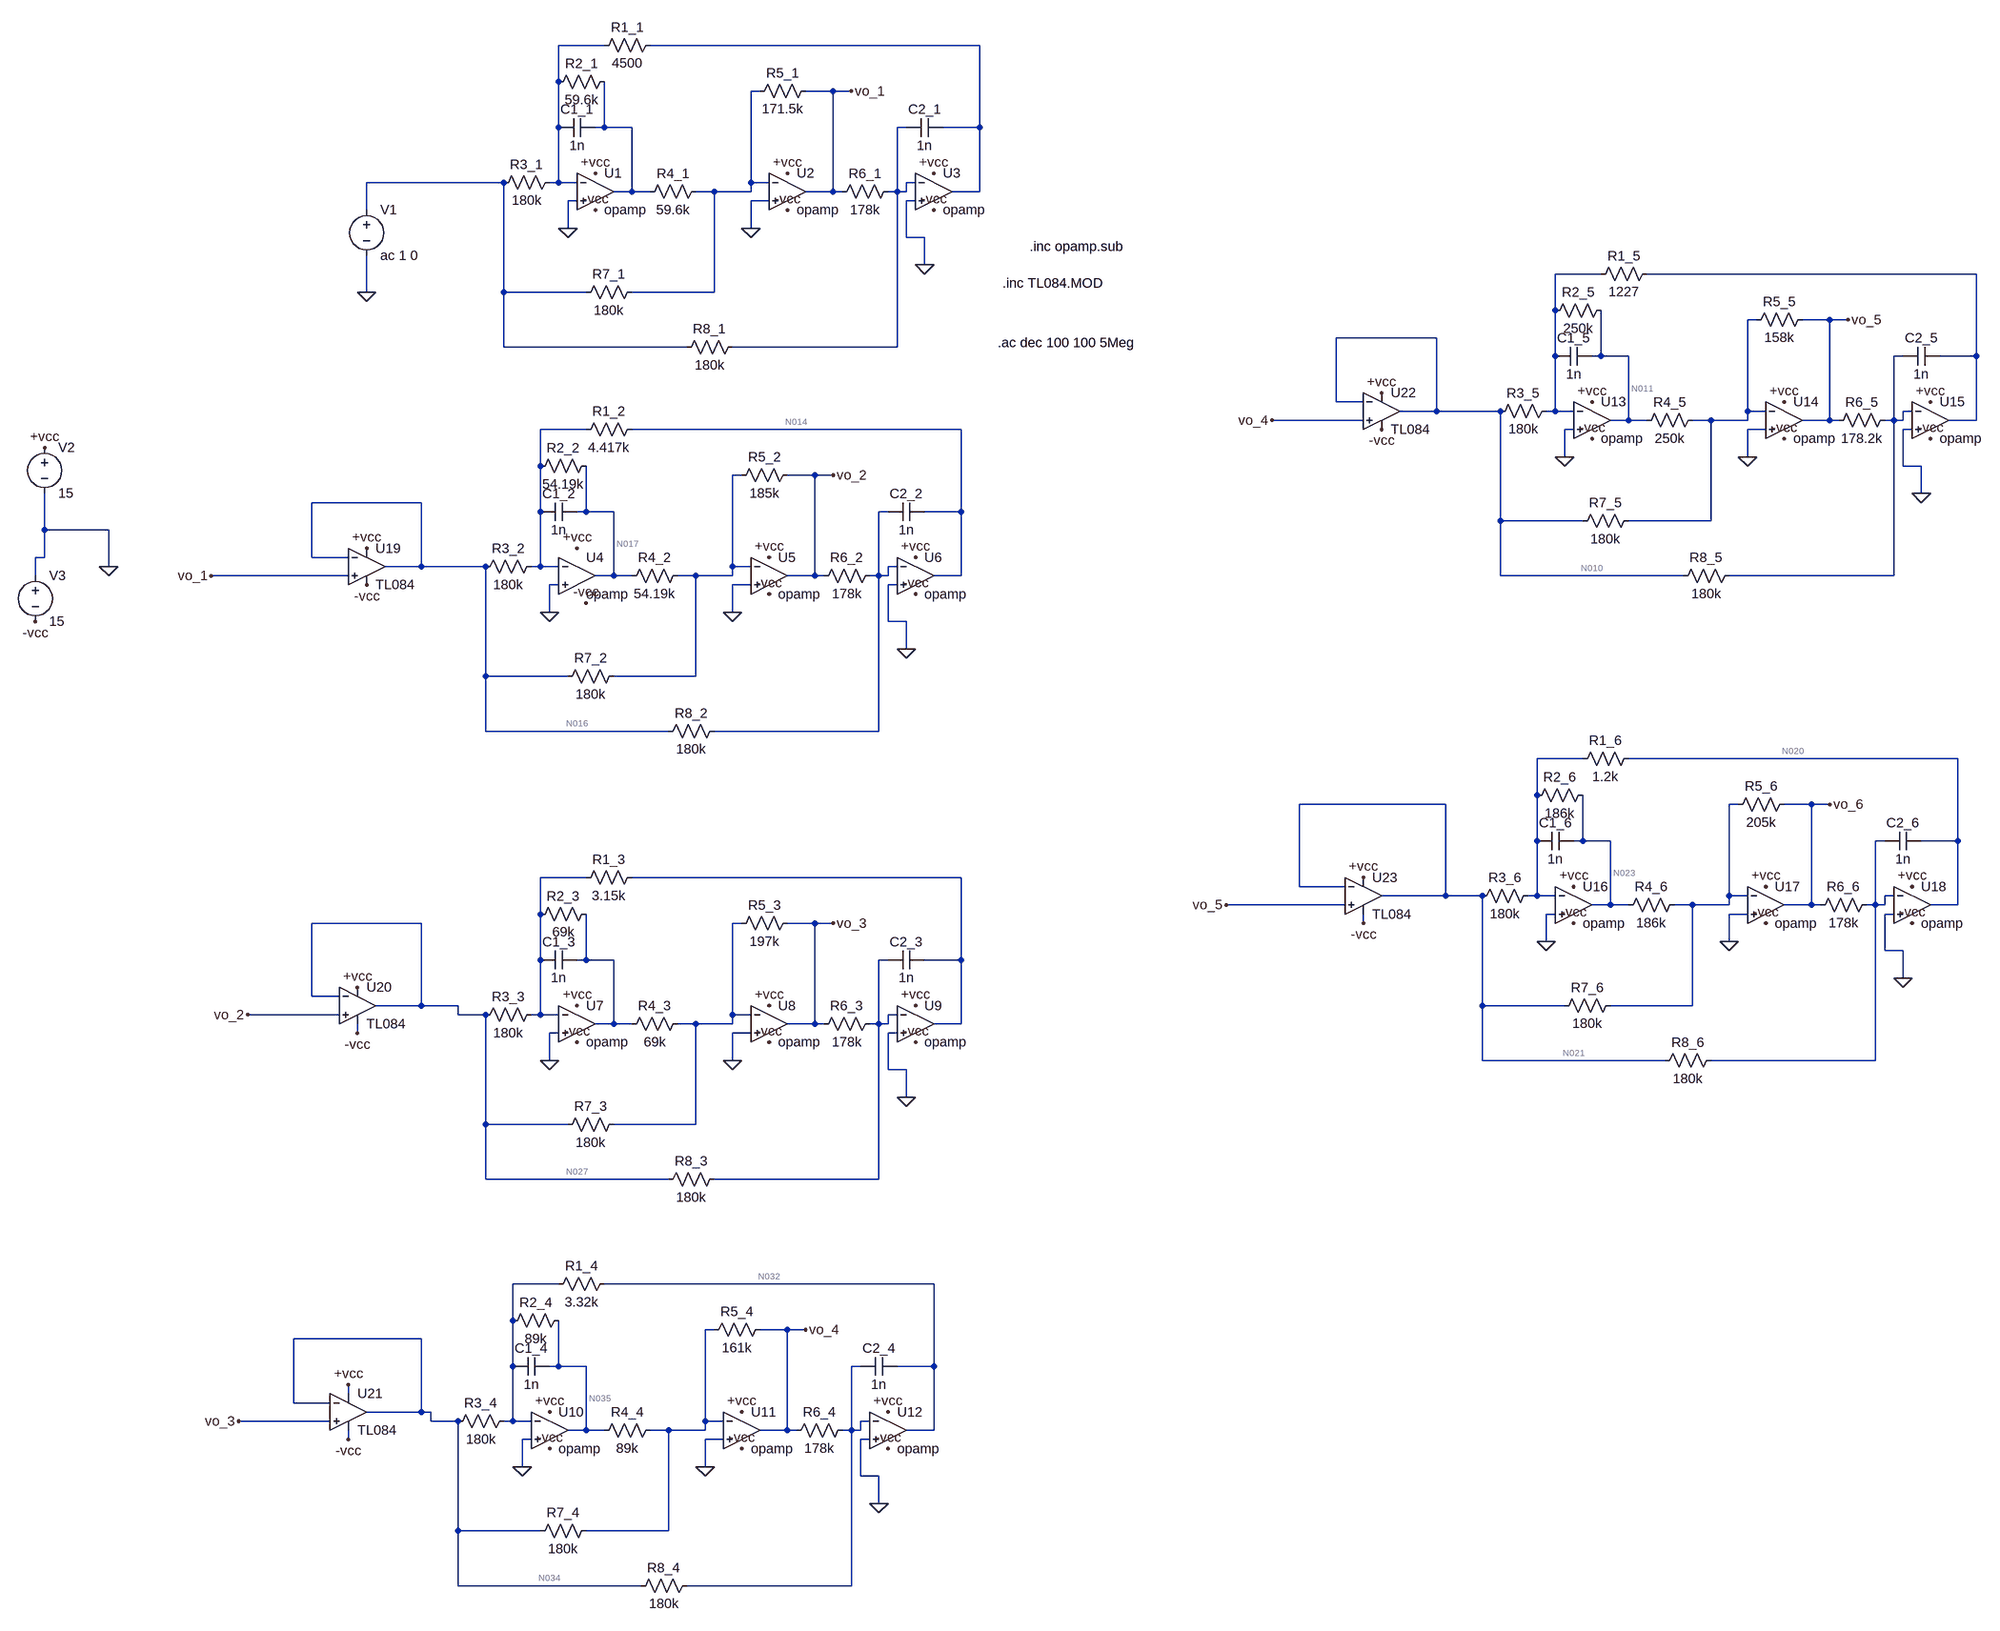
[diagram p0: schematic sim_etapasJuntas_INTENTO3.asc]
sim_etapasJuntas_INTENTO3.asc, the LTspice schematic file:
Version 4
SHEET 1 2280 2644
WIRE -144 -144 -224 -144
WIRE 512 -144 -64 -144
WIRE -224 -80 -224 -144
WIRE 128 -64 112 -64
WIRE 256 -64 208 -64
WIRE 288 -64 256 -64
WIRE -224 0 -224 -80
WIRE -144 0 -144 -80
WIRE -144 0 -160 0
WIRE -96 0 -144 0
WIRE 384 0 368 0
WIRE 512 0 512 -144
WIRE 512 0 448 0
WIRE -320 96 -560 96
WIRE -224 96 -224 0
WIRE -224 96 -240 96
WIRE -192 96 -224 96
WIRE 112 96 112 -64
WIRE 144 96 112 96
WIRE 400 96 384 96
WIRE -96 112 -96 0
WIRE -96 112 -128 112
WIRE -64 112 -96 112
WIRE 48 112 16 112
WIRE 112 112 112 96
WIRE 112 112 48 112
WIRE 256 112 256 -64
WIRE 256 112 208 112
WIRE 272 112 256 112
WIRE 368 112 368 0
WIRE 368 112 352 112
WIRE 384 112 384 96
WIRE 384 112 368 112
WIRE 512 112 512 0
WIRE 512 112 464 112
WIRE -192 128 -208 128
WIRE 144 128 112 128
WIRE 400 128 384 128
WIRE -560 144 -560 96
WIRE -208 176 -208 128
WIRE 112 176 112 128
WIRE 384 192 384 128
WIRE 416 192 384 192
WIRE 416 240 416 192
WIRE 1616 256 1536 256
WIRE 2272 256 1696 256
WIRE -560 288 -560 224
WIRE -320 288 -320 96
WIRE -176 288 -320 288
WIRE 48 288 48 112
WIRE 48 288 -96 288
WIRE 1536 320 1536 256
WIRE 1888 336 1872 336
WIRE 2016 336 1968 336
WIRE 2048 336 2016 336
WIRE 1328 368 1152 368
WIRE -320 384 -320 288
WIRE 0 384 -320 384
WIRE 368 384 368 112
WIRE 368 384 80 384
WIRE 1536 400 1536 320
WIRE 1616 400 1616 320
WIRE 1616 400 1600 400
WIRE 1664 400 1616 400
WIRE 2144 400 2128 400
WIRE 2272 400 2272 256
WIRE 2272 400 2208 400
WIRE 1152 480 1152 368
WIRE 1200 480 1152 480
WIRE 1328 496 1328 368
WIRE 1328 496 1264 496
WIRE 1440 496 1328 496
WIRE 1536 496 1536 400
WIRE 1536 496 1520 496
WIRE 1568 496 1536 496
WIRE 1872 496 1872 336
WIRE 1904 496 1872 496
WIRE 2160 496 2144 496
WIRE 1200 512 1040 512
WIRE 1664 512 1664 400
WIRE 1664 512 1632 512
WIRE 1696 512 1664 512
WIRE 1808 512 1776 512
WIRE 1872 512 1872 496
WIRE 1872 512 1808 512
WIRE 2016 512 2016 336
WIRE 2016 512 1968 512
WIRE 2032 512 2016 512
WIRE 2128 512 2128 400
WIRE 2128 512 2112 512
WIRE 2144 512 2144 496
WIRE 2144 512 2128 512
WIRE 2272 512 2272 400
WIRE 2272 512 2224 512
WIRE -176 528 -256 528
WIRE 480 528 -96 528
WIRE 1568 528 1552 528
WIRE 1904 528 1872 528
WIRE 2160 528 2144 528
WIRE 1552 576 1552 528
WIRE 1872 576 1872 528
WIRE -256 592 -256 528
WIRE 2144 592 2144 528
WIRE 2176 592 2144 592
WIRE 96 608 80 608
WIRE 224 608 176 608
WIRE 256 608 224 608
WIRE 2176 640 2176 592
WIRE -464 656 -656 656
WIRE -256 672 -256 592
WIRE -176 672 -176 592
WIRE -176 672 -192 672
WIRE -128 672 -176 672
WIRE 352 672 336 672
WIRE 480 672 480 528
WIRE 480 672 416 672
WIRE 1440 688 1440 496
WIRE 1584 688 1440 688
WIRE 1808 688 1808 512
WIRE 1808 688 1664 688
WIRE -1520 704 -1520 640
WIRE -1408 704 -1520 704
WIRE -1520 752 -1520 704
WIRE -1520 752 -1536 752
WIRE -656 752 -656 656
WIRE -592 752 -656 752
WIRE -1408 768 -1408 704
WIRE -464 768 -464 656
WIRE -464 768 -528 768
WIRE -352 768 -464 768
WIRE -256 768 -256 672
WIRE -256 768 -272 768
WIRE -224 768 -256 768
WIRE 80 768 80 608
WIRE 112 768 80 768
WIRE 368 768 352 768
WIRE -1536 784 -1536 752
WIRE -592 784 -832 784
WIRE -128 784 -128 672
WIRE -128 784 -160 784
WIRE -96 784 -128 784
WIRE 16 784 -16 784
WIRE 80 784 80 768
WIRE 80 784 16 784
WIRE 224 784 224 608
WIRE 224 784 176 784
WIRE 240 784 224 784
WIRE 336 784 336 672
WIRE 336 784 320 784
WIRE 352 784 352 768
WIRE 352 784 336 784
WIRE 480 784 480 672
WIRE 480 784 432 784
WIRE 1440 784 1440 688
WIRE 1760 784 1440 784
WIRE 2128 784 2128 512
WIRE 2128 784 1840 784
WIRE -224 800 -240 800
WIRE 112 800 80 800
WIRE 368 800 352 800
WIRE -240 848 -240 800
WIRE 80 848 80 800
WIRE 352 864 352 800
WIRE 384 864 352 864
WIRE 384 912 384 864
WIRE -352 960 -352 768
WIRE -208 960 -352 960
WIRE 16 960 16 784
WIRE 16 960 -128 960
WIRE -352 1056 -352 960
WIRE -32 1056 -352 1056
WIRE 336 1056 336 784
WIRE 336 1056 48 1056
WIRE 1584 1104 1504 1104
WIRE 2240 1104 1664 1104
WIRE 1504 1168 1504 1104
WIRE 1344 1184 1088 1184
WIRE 1856 1184 1840 1184
WIRE 1984 1184 1936 1184
WIRE 2016 1184 1984 1184
WIRE 1504 1248 1504 1168
WIRE 1584 1248 1584 1168
WIRE 1584 1248 1568 1248
WIRE 1632 1248 1584 1248
WIRE 2112 1248 2096 1248
WIRE 2240 1248 2240 1104
WIRE 2240 1248 2176 1248
WIRE -176 1312 -256 1312
WIRE 480 1312 -96 1312
WIRE 1088 1328 1088 1184
WIRE 1168 1328 1088 1328
WIRE 1344 1344 1344 1184
WIRE 1344 1344 1232 1344
WIRE 1408 1344 1344 1344
WIRE 1504 1344 1504 1248
WIRE 1504 1344 1488 1344
WIRE 1536 1344 1504 1344
WIRE 1840 1344 1840 1184
WIRE 1872 1344 1840 1344
WIRE 2128 1344 2112 1344
WIRE 1168 1360 960 1360
WIRE 1632 1360 1632 1248
WIRE 1632 1360 1600 1360
WIRE 1664 1360 1632 1360
WIRE 1776 1360 1744 1360
WIRE 1840 1360 1840 1344
WIRE 1840 1360 1776 1360
WIRE 1984 1360 1984 1184
WIRE 1984 1360 1936 1360
WIRE 2000 1360 1984 1360
WIRE 2096 1360 2096 1248
WIRE 2096 1360 2080 1360
WIRE 2112 1360 2112 1344
WIRE 2112 1360 2096 1360
WIRE 2240 1360 2240 1248
WIRE 2240 1360 2192 1360
WIRE -256 1376 -256 1312
WIRE 1536 1376 1520 1376
WIRE 1872 1376 1840 1376
WIRE 2128 1376 2112 1376
WIRE -464 1392 -656 1392
WIRE 96 1392 80 1392
WIRE 224 1392 176 1392
WIRE 256 1392 224 1392
WIRE 1200 1392 1200 1376
WIRE 1520 1424 1520 1376
WIRE 1840 1424 1840 1376
WIRE 2112 1440 2112 1376
WIRE 2144 1440 2112 1440
WIRE -256 1456 -256 1376
WIRE -176 1456 -176 1376
WIRE -176 1456 -192 1456
WIRE -128 1456 -176 1456
WIRE 352 1456 336 1456
WIRE 480 1456 480 1312
WIRE 480 1456 416 1456
WIRE 2144 1488 2144 1440
WIRE -656 1520 -656 1392
WIRE -608 1520 -656 1520
WIRE -464 1536 -464 1392
WIRE -464 1536 -544 1536
WIRE -400 1536 -464 1536
WIRE 1408 1536 1408 1344
WIRE 1552 1536 1408 1536
WIRE 1776 1536 1776 1360
WIRE 1776 1536 1632 1536
WIRE -608 1552 -768 1552
WIRE -400 1552 -400 1536
WIRE -352 1552 -400 1552
WIRE -256 1552 -256 1456
WIRE -256 1552 -272 1552
WIRE -224 1552 -256 1552
WIRE 80 1552 80 1392
WIRE 112 1552 80 1552
WIRE 368 1552 352 1552
WIRE -128 1568 -128 1456
WIRE -128 1568 -160 1568
WIRE -96 1568 -128 1568
WIRE 16 1568 -16 1568
WIRE 80 1568 80 1552
WIRE 80 1568 16 1568
WIRE 224 1568 224 1392
WIRE 224 1568 176 1568
WIRE 240 1568 224 1568
WIRE 336 1568 336 1456
WIRE 336 1568 320 1568
WIRE 352 1568 352 1552
WIRE 352 1568 336 1568
WIRE 480 1568 480 1456
WIRE 480 1568 432 1568
WIRE -576 1584 -576 1568
WIRE -224 1584 -240 1584
WIRE 112 1584 80 1584
WIRE 368 1584 352 1584
WIRE -240 1632 -240 1584
WIRE 80 1632 80 1584
WIRE 1408 1632 1408 1536
WIRE 1728 1632 1408 1632
WIRE 2096 1632 2096 1360
WIRE 2096 1632 1808 1632
WIRE 352 1648 352 1584
WIRE 384 1648 352 1648
WIRE 384 1696 384 1648
WIRE -352 1744 -352 1552
WIRE -208 1744 -352 1744
WIRE 16 1744 16 1568
WIRE 16 1744 -128 1744
WIRE -352 1840 -352 1744
WIRE -32 1840 -352 1840
WIRE 336 1840 336 1568
WIRE 336 1840 48 1840
WIRE -224 2048 -304 2048
WIRE 432 2048 -144 2048
WIRE -304 2112 -304 2048
WIRE 48 2128 32 2128
WIRE 176 2128 128 2128
WIRE 208 2128 176 2128
WIRE -464 2144 -688 2144
WIRE -304 2192 -304 2112
WIRE -224 2192 -224 2112
WIRE -224 2192 -240 2192
WIRE -176 2192 -224 2192
WIRE 304 2192 288 2192
WIRE 432 2192 432 2048
WIRE 432 2192 368 2192
WIRE -592 2240 -592 2224
WIRE -688 2256 -688 2144
WIRE -624 2256 -688 2256
WIRE -464 2272 -464 2144
WIRE -464 2272 -560 2272
WIRE -448 2272 -464 2272
WIRE -624 2288 -784 2288
WIRE -448 2288 -448 2272
WIRE -400 2288 -448 2288
WIRE -304 2288 -304 2192
WIRE -304 2288 -320 2288
WIRE -272 2288 -304 2288
WIRE 32 2288 32 2128
WIRE 64 2288 32 2288
WIRE 320 2288 304 2288
WIRE -176 2304 -176 2192
WIRE -176 2304 -208 2304
WIRE -144 2304 -176 2304
WIRE -32 2304 -64 2304
WIRE 32 2304 32 2288
WIRE 32 2304 -32 2304
WIRE 176 2304 176 2128
WIRE 176 2304 128 2304
WIRE 192 2304 176 2304
WIRE 288 2304 288 2192
WIRE 288 2304 272 2304
WIRE 304 2304 304 2288
WIRE 304 2304 288 2304
WIRE 432 2304 432 2192
WIRE 432 2304 384 2304
WIRE -592 2320 -592 2304
WIRE -272 2320 -288 2320
WIRE 64 2320 32 2320
WIRE 320 2320 304 2320
WIRE -288 2368 -288 2320
WIRE 32 2368 32 2320
WIRE 304 2384 304 2320
WIRE 336 2384 304 2384
WIRE 336 2432 336 2384
WIRE -400 2480 -400 2288
WIRE -256 2480 -400 2480
WIRE -32 2480 -32 2304
WIRE -32 2480 -176 2480
WIRE -400 2576 -400 2480
WIRE -80 2576 -400 2576
WIRE 288 2576 288 2304
WIRE 288 2576 0 2576
FLAG -160 80 +vcc
FLAG 176 80 +vcc
FLAG 432 80 +vcc
FLAG -160 144 -vcc
FLAG 176 144 -vcc
FLAG 432 144 -vcc
FLAG -208 176 0
FLAG 112 176 0
FLAG 416 240 0
FLAG 288 -64 vo_1
FLAG -192 736 +vcc
FLAG 144 752 +vcc
FLAG 400 752 +vcc
FLAG -176 832 -vcc
FLAG 144 816 -vcc
FLAG 400 816 -vcc
FLAG -240 848 0
FLAG 80 848 0
FLAG 384 912 0
FLAG 256 608 vo_2
FLAG -192 1536 +vcc
FLAG 144 1536 +vcc
FLAG 400 1536 +vcc
FLAG -192 1600 -vcc
FLAG 144 1600 -vcc
FLAG 400 1600 -vcc
FLAG -240 1632 0
FLAG 80 1632 0
FLAG 384 1696 0
FLAG 256 1392 vo_3
FLAG -240 2272 +vcc
FLAG 96 2272 +vcc
FLAG 352 2272 +vcc
FLAG -240 2336 -vcc
FLAG 96 2336 -vcc
FLAG 352 2336 -vcc
FLAG -288 2368 0
FLAG 32 2368 0
FLAG 336 2432 0
FLAG 208 2128 vo_4
FLAG 1600 480 +vcc
FLAG 1936 480 +vcc
FLAG 2192 480 +vcc
FLAG 1600 544 -vcc
FLAG 1936 544 -vcc
FLAG 2192 544 -vcc
FLAG 1552 576 0
FLAG 1872 576 0
FLAG 2176 640 0
FLAG 2048 336 vo_5
FLAG 1568 1328 +vcc
FLAG 1904 1328 +vcc
FLAG 2160 1328 +vcc
FLAG 1568 1392 -vcc
FLAG 1904 1392 -vcc
FLAG 2160 1392 -vcc
FLAG 1520 1424 0
FLAG 1840 1424 0
FLAG 2144 1488 0
FLAG 2016 1184 vo_6
FLAG -560 288 0
FLAG -560 736 +vcc
FLAG -576 1504 +vcc
FLAG -592 2224 +vcc
FLAG 1232 464 +vcc
FLAG 1200 1312 +vcc
FLAG -560 800 -vcc
FLAG -576 1584 -vcc
FLAG -592 2320 -vcc
FLAG 1200 1392 -vcc
FLAG 1232 528 -vcc
FLAG -832 784 vo_1
FLAG -768 1552 vo_2
FLAG 1040 512 vo_4
FLAG 960 1360 vo_5
FLAG -784 2288 vo_3
FLAG -1408 768 0
FLAG -1536 864 -vcc
FLAG -1520 560 +vcc
SYMBOL res -48 -160 R90
WINDOW 0 0 56 VBottom 2
WINDOW 3 32 56 VTop 2
SYMATTR InstName R1_1
SYMATTR Value 4500
SYMBOL res -128 -96 R90
WINDOW 0 0 56 VBottom 2
WINDOW 3 32 56 VTop 2
SYMATTR InstName R2_1
SYMATTR Value 59.6k
SYMBOL res -224 80 R90
WINDOW 0 0 56 VBottom 2
WINDOW 3 32 56 VTop 2
SYMATTR InstName R3_1
SYMATTR Value 180k
SYMBOL res 32 96 R90
WINDOW 0 0 56 VBottom 2
WINDOW 3 32 56 VTop 2
SYMATTR InstName R4_1
SYMATTR Value 59.6k
SYMBOL res 224 -80 R90
WINDOW 0 0 56 VBottom 2
WINDOW 3 32 56 VTop 2
SYMATTR InstName R5_1
SYMATTR Value 171.5k
SYMBOL res 368 96 R90
WINDOW 0 0 56 VBottom 2
WINDOW 3 32 56 VTop 2
SYMATTR InstName R6_1
SYMATTR Value 178k
SYMBOL res -80 272 R90
WINDOW 0 0 56 VBottom 2
WINDOW 3 32 56 VTop 2
SYMATTR InstName R7_1
SYMATTR Value 180k
SYMBOL res 96 368 R90
WINDOW 0 0 56 VBottom 2
WINDOW 3 32 56 VTop 2
SYMATTR InstName R8_1
SYMATTR Value 180k
SYMBOL cap -160 -16 R90
WINDOW 0 0 32 VBottom 2
WINDOW 3 32 32 VTop 2
SYMATTR InstName C1_1
SYMATTR Value 1n
SYMBOL cap 448 -16 R90
WINDOW 0 0 32 VBottom 2
WINDOW 3 32 32 VTop 2
SYMATTR InstName C2_1
SYMATTR Value 1n
SYMBOL res -80 512 R90
WINDOW 0 0 56 VBottom 2
WINDOW 3 32 56 VTop 2
SYMATTR InstName R1_2
SYMATTR Value 4.417k
SYMBOL res -160 576 R90
WINDOW 0 0 56 VBottom 2
WINDOW 3 32 56 VTop 2
SYMATTR InstName R2_2
SYMATTR Value 54.19k
SYMBOL res -256 752 R90
WINDOW 0 0 56 VBottom 2
WINDOW 3 32 56 VTop 2
SYMATTR InstName R3_2
SYMATTR Value 180k
SYMBOL res 0 768 R90
WINDOW 0 0 56 VBottom 2
WINDOW 3 32 56 VTop 2
SYMATTR InstName R4_2
SYMATTR Value 54.19k
SYMBOL res 192 592 R90
WINDOW 0 0 56 VBottom 2
WINDOW 3 32 56 VTop 2
SYMATTR InstName R5_2
SYMATTR Value 185k
SYMBOL res 336 768 R90
WINDOW 0 0 56 VBottom 2
WINDOW 3 32 56 VTop 2
SYMATTR InstName R6_2
SYMATTR Value 178k
SYMBOL res -112 944 R90
WINDOW 0 0 56 VBottom 2
WINDOW 3 32 56 VTop 2
SYMATTR InstName R7_2
SYMATTR Value 180k
SYMBOL res 64 1040 R90
WINDOW 0 0 56 VBottom 2
WINDOW 3 32 56 VTop 2
SYMATTR InstName R8_2
SYMATTR Value 180k
SYMBOL cap -192 656 R90
WINDOW 0 0 32 VBottom 2
WINDOW 3 32 32 VTop 2
SYMATTR InstName C1_2
SYMATTR Value 1n
SYMBOL cap 416 656 R90
WINDOW 0 0 32 VBottom 2
WINDOW 3 32 32 VTop 2
SYMATTR InstName C2_2
SYMATTR Value 1n
SYMBOL res -80 1296 R90
WINDOW 0 0 56 VBottom 2
WINDOW 3 32 56 VTop 2
SYMATTR InstName R1_3
SYMATTR Value 3.15k
SYMBOL res -160 1360 R90
WINDOW 0 0 56 VBottom 2
WINDOW 3 32 56 VTop 2
SYMATTR InstName R2_3
SYMATTR Value 69k
SYMBOL res -256 1536 R90
WINDOW 0 0 56 VBottom 2
WINDOW 3 32 56 VTop 2
SYMATTR InstName R3_3
SYMATTR Value 180k
SYMBOL res 0 1552 R90
WINDOW 0 0 56 VBottom 2
WINDOW 3 32 56 VTop 2
SYMATTR InstName R4_3
SYMATTR Value 69k
SYMBOL res 192 1376 R90
WINDOW 0 0 56 VBottom 2
WINDOW 3 32 56 VTop 2
SYMATTR InstName R5_3
SYMATTR Value 197k
SYMBOL res 336 1552 R90
WINDOW 0 0 56 VBottom 2
WINDOW 3 32 56 VTop 2
SYMATTR InstName R6_3
SYMATTR Value 178k
SYMBOL res -112 1728 R90
WINDOW 0 0 56 VBottom 2
WINDOW 3 32 56 VTop 2
SYMATTR InstName R7_3
SYMATTR Value 180k
SYMBOL res 64 1824 R90
WINDOW 0 0 56 VBottom 2
WINDOW 3 32 56 VTop 2
SYMATTR InstName R8_3
SYMATTR Value 180k
SYMBOL cap -192 1440 R90
WINDOW 0 0 32 VBottom 2
WINDOW 3 32 32 VTop 2
SYMATTR InstName C1_3
SYMATTR Value 1n
SYMBOL cap 416 1440 R90
WINDOW 0 0 32 VBottom 2
WINDOW 3 32 32 VTop 2
SYMATTR InstName C2_3
SYMATTR Value 1n
SYMBOL res -128 2032 R90
WINDOW 0 0 56 VBottom 2
WINDOW 3 32 56 VTop 2
SYMATTR InstName R1_4
SYMATTR Value 3.32k
SYMBOL res -208 2096 R90
WINDOW 0 0 56 VBottom 2
WINDOW 3 32 56 VTop 2
SYMATTR InstName R2_4
SYMATTR Value 89k
SYMBOL res -304 2272 R90
WINDOW 0 0 56 VBottom 2
WINDOW 3 32 56 VTop 2
SYMATTR InstName R3_4
SYMATTR Value 180k
SYMBOL res -48 2288 R90
WINDOW 0 0 56 VBottom 2
WINDOW 3 32 56 VTop 2
SYMATTR InstName R4_4
SYMATTR Value 89k
SYMBOL res 144 2112 R90
WINDOW 0 0 56 VBottom 2
WINDOW 3 32 56 VTop 2
SYMATTR InstName R5_4
SYMATTR Value 161k
SYMBOL res 288 2288 R90
WINDOW 0 0 56 VBottom 2
WINDOW 3 32 56 VTop 2
SYMATTR InstName R6_4
SYMATTR Value 178k
SYMBOL res -160 2464 R90
WINDOW 0 0 56 VBottom 2
WINDOW 3 32 56 VTop 2
SYMATTR InstName R7_4
SYMATTR Value 180k
SYMBOL res 16 2560 R90
WINDOW 0 0 56 VBottom 2
WINDOW 3 32 56 VTop 2
SYMATTR InstName R8_4
SYMATTR Value 180k
SYMBOL cap -240 2176 R90
WINDOW 0 0 32 VBottom 2
WINDOW 3 32 32 VTop 2
SYMATTR InstName C1_4
SYMATTR Value 1n
SYMBOL cap 368 2176 R90
WINDOW 0 0 32 VBottom 2
WINDOW 3 32 32 VTop 2
SYMATTR InstName C2_4
SYMATTR Value 1n
SYMBOL res 1712 240 R90
WINDOW 0 0 56 VBottom 2
WINDOW 3 32 56 VTop 2
SYMATTR InstName R1_5
SYMATTR Value 1227
SYMBOL res 1632 304 R90
WINDOW 0 0 56 VBottom 2
WINDOW 3 32 56 VTop 2
SYMATTR InstName R2_5
SYMATTR Value 250k
SYMBOL res 1536 480 R90
WINDOW 0 0 56 VBottom 2
WINDOW 3 32 56 VTop 2
SYMATTR InstName R3_5
SYMATTR Value 180k
SYMBOL res 1792 496 R90
WINDOW 0 0 56 VBottom 2
WINDOW 3 32 56 VTop 2
SYMATTR InstName R4_5
SYMATTR Value 250k
SYMBOL res 1984 320 R90
WINDOW 0 0 56 VBottom 2
WINDOW 3 32 56 VTop 2
SYMATTR InstName R5_5
SYMATTR Value 158k
SYMBOL res 2128 496 R90
WINDOW 0 0 56 VBottom 2
WINDOW 3 32 56 VTop 2
SYMATTR InstName R6_5
SYMATTR Value 178.2k
SYMBOL res 1680 672 R90
WINDOW 0 0 56 VBottom 2
WINDOW 3 32 56 VTop 2
SYMATTR InstName R7_5
SYMATTR Value 180k
SYMBOL res 1856 768 R90
WINDOW 0 0 56 VBottom 2
WINDOW 3 32 56 VTop 2
SYMATTR InstName R8_5
SYMATTR Value 180k
SYMBOL cap 1600 384 R90
WINDOW 0 0 32 VBottom 2
WINDOW 3 32 32 VTop 2
SYMATTR InstName C1_5
SYMATTR Value 1n
SYMBOL cap 2208 384 R90
WINDOW 0 0 32 VBottom 2
WINDOW 3 32 32 VTop 2
SYMATTR InstName C2_5
SYMATTR Value 1n
SYMBOL res 1680 1088 R90
WINDOW 0 0 56 VBottom 2
WINDOW 3 32 56 VTop 2
SYMATTR InstName R1_6
SYMATTR Value 1.2k
SYMBOL res 1600 1152 R90
WINDOW 0 0 56 VBottom 2
WINDOW 3 32 56 VTop 2
SYMATTR InstName R2_6
SYMATTR Value 186k
SYMBOL res 1504 1328 R90
WINDOW 0 0 56 VBottom 2
WINDOW 3 32 56 VTop 2
SYMATTR InstName R3_6
SYMATTR Value 180k
SYMBOL res 1760 1344 R90
WINDOW 0 0 56 VBottom 2
WINDOW 3 32 56 VTop 2
SYMATTR InstName R4_6
SYMATTR Value 186k
SYMBOL res 1952 1168 R90
WINDOW 0 0 56 VBottom 2
WINDOW 3 32 56 VTop 2
SYMATTR InstName R5_6
SYMATTR Value 205k
SYMBOL res 2096 1344 R90
WINDOW 0 0 56 VBottom 2
WINDOW 3 32 56 VTop 2
SYMATTR InstName R6_6
SYMATTR Value 178k
SYMBOL res 1648 1520 R90
WINDOW 0 0 56 VBottom 2
WINDOW 3 32 56 VTop 2
SYMATTR InstName R7_6
SYMATTR Value 180k
SYMBOL res 1824 1616 R90
WINDOW 0 0 56 VBottom 2
WINDOW 3 32 56 VTop 2
SYMATTR InstName R8_6
SYMATTR Value 180k
SYMBOL cap 1568 1232 R90
WINDOW 0 0 32 VBottom 2
WINDOW 3 32 32 VTop 2
SYMATTR InstName C1_6
SYMATTR Value 1n
SYMBOL cap 2176 1232 R90
WINDOW 0 0 32 VBottom 2
WINDOW 3 32 32 VTop 2
SYMATTR InstName C2_6
SYMATTR Value 1n
SYMBOL voltage -560 128 R0
SYMATTR InstName V1
SYMATTR Value ac 1 0
SYMBOL Opamps\\opamp2 -560 704 R0
SYMATTR InstName U19
SYMATTR Value TL084
SYMBOL Opamps\\opamp2 -576 1472 R0
SYMATTR InstName U20
SYMATTR Value TL084
SYMBOL Opamps\\opamp2 -592 2208 R0
SYMATTR InstName U21
SYMATTR Value TL084
SYMBOL Opamps\\opamp2 1232 432 R0
SYMATTR InstName U22
SYMATTR Value TL084
SYMBOL Opamps\\opamp2 1200 1280 R0
SYMATTR InstName U23
SYMATTR Value TL084
SYMBOL voltage -1520 544 R0
SYMATTR InstName V2
SYMATTR Value 15
SYMBOL voltage -1536 768 R0
SYMATTR InstName V3
SYMATTR Value 15
SYMBOL Opamps\\opamp -160 48 R0
SYMATTR InstName U1
SYMBOL Opamps\\opamp 176 48 R0
SYMATTR InstName U2
SYMBOL Opamps\\opamp 432 48 R0
SYMATTR InstName U3
SYMBOL Opamps\\opamp -192 720 R0
SYMATTR InstName U4
SYMBOL Opamps\\opamp 144 720 R0
SYMATTR InstName U5
SYMBOL Opamps\\opamp 400 720 R0
SYMATTR InstName U6
SYMBOL Opamps\\opamp -192 1504 R0
SYMATTR InstName U7
SYMBOL Opamps\\opamp 144 1504 R0
SYMATTR InstName U8
SYMBOL Opamps\\opamp 400 1504 R0
SYMATTR InstName U9
SYMBOL Opamps\\opamp -240 2240 R0
SYMATTR InstName U10
SYMBOL Opamps\\opamp 96 2240 R0
SYMATTR InstName U11
SYMBOL Opamps\\opamp 352 2240 R0
SYMATTR InstName U12
SYMBOL Opamps\\opamp 1600 448 R0
SYMATTR InstName U13
SYMBOL Opamps\\opamp 1936 448 R0
SYMATTR InstName U14
SYMBOL Opamps\\opamp 2192 448 R0
SYMATTR InstName U15
SYMBOL Opamps\\opamp 1568 1296 R0
SYMATTR InstName U16
SYMBOL Opamps\\opamp 1904 1296 R0
SYMATTR InstName U17
SYMBOL Opamps\\opamp 2160 1296 R0
SYMATTR InstName U18
TEXT 552 272 Left 2 !.inc TL084.MOD
TEXT 544 376 Left 2 !.ac dec 100 100 5Meg
TEXT 600 208 Left 2 !.inc opamp.sub

The netlist it stands for:
* sim_etapasJuntas_INTENTO3.asc
R1_1 N002 N001 4500
R2_1 N004 N001 59.6k
R3_1 N001 N006 180k
R4_1 N003 N004 59.6k
R5_1 vo_1 N003 171.5k
R6_1 N005 vo_1 178k
R7_1 N003 N006 180k
R8_1 N005 N006 180k
C1_1 N004 N001 1n
C2_1 N002 N005 1n
R1_2 N014 N013 4.417k
R2_2 N017 N013 54.19k
R3_2 N013 N016 180k
R4_2 N015 N017 54.19k
R5_2 vo_2 N015 185k
R6_2 N018 vo_2 178k
R7_2 N015 N016 180k
R8_2 N018 N016 180k
C1_2 N017 N013 1n
C2_2 N014 N018 1n
R1_3 N026 N025 3.15k
R2_3 N029 N025 69k
R3_3 N025 N027 180k
R4_3 N028 N029 69k
R5_3 vo_3 N028 197k
R6_3 N030 vo_3 178k
R7_3 N028 N027 180k
R8_3 N030 N027 180k
C1_3 N029 N025 1n
C2_3 N026 N030 1n
R1_4 N032 N031 3.32k
R2_4 N035 N031 89k
R3_4 N031 N034 180k
R4_4 N033 N035 89k
R5_4 vo_4 N033 161k
R6_4 N036 vo_4 178k
R7_4 N033 N034 180k
R8_4 N036 N034 180k
C1_4 N035 N031 1n
C2_4 N032 N036 1n
R1_5 N008 N007 1227
R2_5 N011 N007 250k
R3_5 N007 N010 180k
R4_5 N009 N011 250k
R5_5 vo_5 N009 158k
R6_5 N012 vo_5 178.2k
R7_5 N009 N010 180k
R8_5 N012 N010 180k
C1_5 N011 N007 1n
C2_5 N008 N012 1n
R1_6 N020 N019 1.2k
R2_6 N023 N019 186k
R3_6 N019 N021 180k
R4_6 N022 N023 186k
R5_6 vo_6 N022 205k
R6_6 N024 vo_6 178k
R7_6 N022 N021 180k
R8_6 N024 N021 180k
C1_6 N023 N019 1n
C2_6 N020 N024 1n
V1 N006 0 ac 1 0
XU19 vo_1 N016 +vcc -vcc N016 TL084  ; pins In+ In- V+ V- OUT
XU20 vo_2 N027 +vcc -vcc N027 TL084  ; pins In+ In- V+ V- OUT
XU21 vo_3 N034 +vcc -vcc N034 TL084  ; pins In+ In- V+ V- OUT
XU22 vo_4 N010 +vcc -vcc N010 TL084  ; pins In+ In- V+ V- OUT
XU23 vo_5 N021 +vcc -vcc N021 TL084  ; pins In+ In- V+ V- OUT
V2 +vcc 0 15
V3 0 -vcc 15
XU1 N001 0 N004 opamp Aol=100K GBW=10Meg  ; pins invin noninvin out
XU2 N003 0 vo_1 opamp Aol=100K GBW=10Meg  ; pins invin noninvin out
XU3 N005 0 N002 opamp Aol=100K GBW=10Meg  ; pins invin noninvin out
XU4 N013 0 N017 opamp Aol=100K GBW=10Meg  ; pins invin noninvin out
XU5 N015 0 vo_2 opamp Aol=100K GBW=10Meg  ; pins invin noninvin out
XU6 N018 0 N014 opamp Aol=100K GBW=10Meg  ; pins invin noninvin out
XU7 N025 0 N029 opamp Aol=100K GBW=10Meg  ; pins invin noninvin out
XU8 N028 0 vo_3 opamp Aol=100K GBW=10Meg  ; pins invin noninvin out
XU9 N030 0 N026 opamp Aol=100K GBW=10Meg  ; pins invin noninvin out
XU10 N031 0 N035 opamp Aol=100K GBW=10Meg  ; pins invin noninvin out
XU11 N033 0 vo_4 opamp Aol=100K GBW=10Meg  ; pins invin noninvin out
XU12 N036 0 N032 opamp Aol=100K GBW=10Meg  ; pins invin noninvin out
XU13 N007 0 N011 opamp Aol=100K GBW=10Meg  ; pins invin noninvin out
XU14 N009 0 vo_5 opamp Aol=100K GBW=10Meg  ; pins invin noninvin out
XU15 N012 0 N008 opamp Aol=100K GBW=10Meg  ; pins invin noninvin out
XU16 N019 0 N023 opamp Aol=100K GBW=10Meg  ; pins invin noninvin out
XU17 N022 0 vo_6 opamp Aol=100K GBW=10Meg  ; pins invin noninvin out
XU18 N024 0 N020 opamp Aol=100K GBW=10Meg  ; pins invin noninvin out
.inc TL084.MOD
.ac dec 100 100 5Meg
.inc opamp.sub
.backanno
.end

* Results of the author's LTspice run, read from the files saved beside the schematic
* Operating Point, zero values left out:
*   V(n014) = -259 nV
*   V(n017) = -124.8 nV
*   V(n016) = 10.97 µV
*   V(vo_2) = -10.85 µV
*   V(n027) = 122.2 nV
*   V(vo_3) = -120.9 nV
*   V(n032) = -221.3 nV
*   V(n035) = 566.7 nV
*   V(n034) = 10.85 µV
*   V(vo_4) = -10.73 µV
*   V(n011) = 42.94 nV
*   V(n010) = 241.8 nV
*   V(vo_5) = -239.4 nV
*   V(n020) = -62.11 nV
*   V(n023) = -1.46 µV
*   V(n021) = 10.73 µV
*   V(vo_6) = -10.61 µV
*   V(-vcc) = -15 V
*   V(+vcc) = 15 V
*   I(R8_6) = -59.62 pA
*   I(R7_6) = -59.62 pA
*   I(R6_6) = 59.62 pA
*   I(R5_6) = -51.77 pA
*   I(R4_6) = 7.851 pA
*   I(R3_6) = -59.62 pA
*   I(R2_6) = -7.851 pA
*   I(R1_6) = -51.77 pA
*   I(R8_5) = -1.343 pA
*   I(R7_5) = -1.343 pA
*   I(R6_5) = 1.343 pA
*   I(R5_5) = -1.515 pA
*   I(R3_5) = -1.343 pA
*   I(R1_5) = -1.515 pA
*   I(R8_4) = -60.28 pA
*   I(R7_4) = -60.28 pA
*   I(R6_4) = 60.28 pA
*   I(R5_4) = -66.64 pA
*   I(R4_4) = -6.366 pA
*   I(R3_4) = -60.28 pA
*   I(R2_4) = 6.367 pA
*   I(R1_4) = -66.64 pA
*   I(R8_2) = -60.95 pA
*   I(R7_2) = -60.95 pA
*   I(R6_2) = 60.95 pA
*   I(R5_2) = -58.64 pA
*   I(R4_2) = 2.305 pA
*   I(R3_2) = -60.95 pA
*   I(R2_2) = -2.303 pA
*   I(R1_2) = -58.65 pA
*   I(V3) = -70.97 mA
*   I(V2) = -70.97 mA
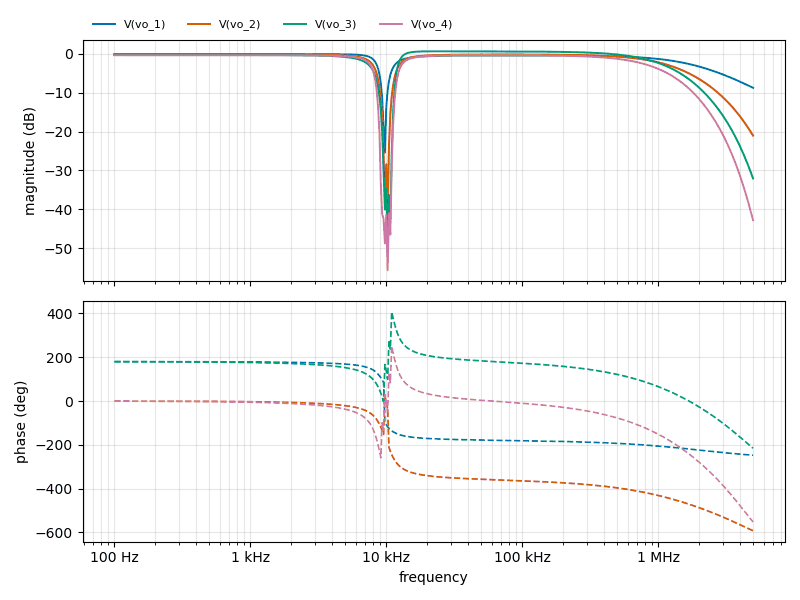
[diagram p1: AC Analysis of sim_etapasJuntas_INTENTO3.asc, plotted from the saved traces]
* AC Analysis, 1 run:
*   V(vo_1): -0.10 dB at 100 Hz, -8.76 dB at 5 MHz, peak -0.10 dB at 100 Hz, 3 dB below the peak at 8.56 kHz
*   V(vo_2): -0.19 dB at 100 Hz, -21.06 dB at 5 MHz, peak -0.19 dB at 100 Hz, 3 dB below the peak at 8.062 kHz
*   V(vo_3): -0.29 dB at 100 Hz, -32.09 dB at 5 MHz, peak 0.63 dB at 23.99 kHz, 3 dB below the peak at 12.34 kHz and 1.005 MHz
*   V(vo_4): -0.39 dB at 100 Hz, -42.80 dB at 5 MHz, peak -0.39 dB at 100 Hz, 3 dB below the peak at 7.78 kHz